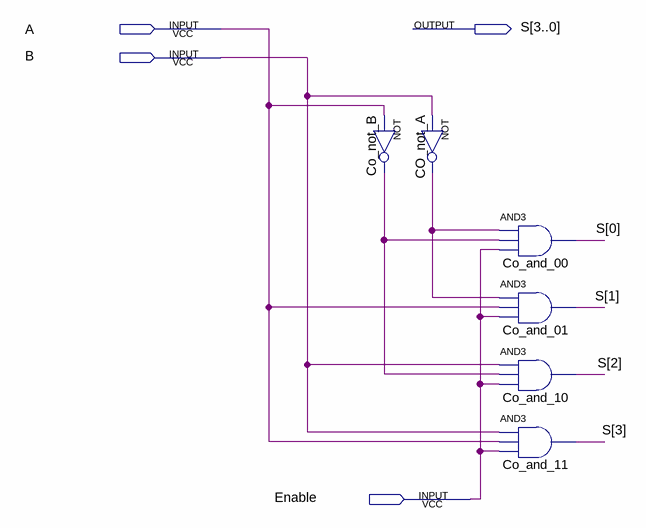
[diagram p0: schematic sheet]
// Quartus schematic decoder2x4e.bdf as structural Verilog: 6 symbols, 4 pins
module decoder2x4e (
  input  A,
  input  B,
  input  Enable,
  output [3:0] S
);

  wire CO_not_A_out, Co_not_B_out;

  not Co_not_B (Co_not_B_out, A);
  not CO_not_A (CO_not_A_out, B);
  and Co_and_00 (S[0], CO_not_A_out, Co_not_B_out, Enable);
  and Co_and_01 (S[1], CO_not_A_out, A, Enable);
  and Co_and_10 (S[2], B, Co_not_B_out, Enable);
  and Co_and_11 (S[3], B, A, Enable);
endmodule
